# EAGLE schematic AmiExtFDD (EAGLE 6.5.0)
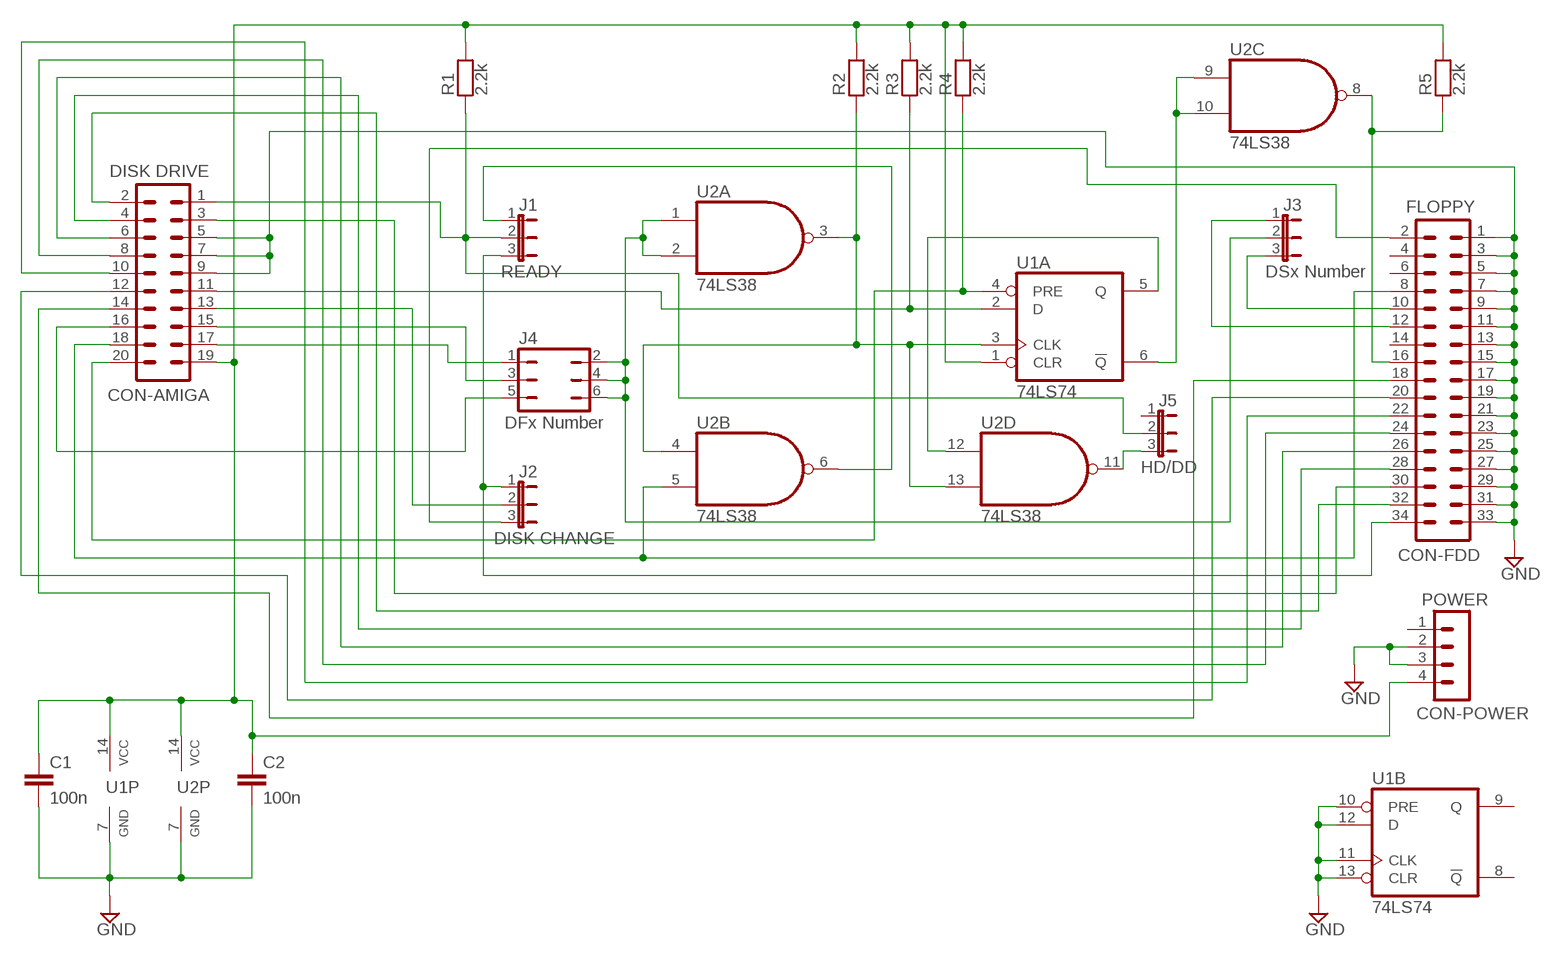
[diagram p0: schematic, sheet 1]

## Parts
C1  100n  PAD-C5SMD  [SMD-UNI]
C2  100n  PAD-C5SMD  [SMD-UNI]
CON-AMIGA  DISK DRIVE  IDC20  [IDC20]
CON-FDD  FLOPPY  FDD2  [FDD2]
CON-POWER  POWER  MIN-MOLEX  [MINI-MOLEX]
J1  READY  PAD-JP3X1UNI  [JP3X1-UNI]
J2  DISK CHANGE  PAD-JP3X1UNI  [JP3X1-UNI]
J3  DSx Number  PAD-JP3X1UNI  [JP3X1-UNI]
J4  DFx Number  PAD-JP3X2UNI  [JP3X2-UNI]
J5  HD/DD  PAD-JP3X1UNI  [JP3X1-UNI]
R1  2.2k  PAD-R10SMD  [SMD-UNI]
R2  2.2k  PAD-R10SMD  [SMD-UNI]
R3  2.2k  PAD-R10SMD  [SMD-UNI]
R4  2.2k  PAD-R10SMD  [SMD-UNI]
R5  2.2k  PAD-R10SMD  [SMD-UNI]
U1  74LS74  PAD-7474SO14  [SO14]
U2  74LS38  PAD-7438SO14  [SO14]

## Nets
GND: C1.2 C2.2 CON-AMIGA.5 CON-AMIGA.7 CON-AMIGA.9 CON-FDD.1 CON-FDD.3 CON-FDD.5 CON-FDD.7 CON-FDD.9 CON-FDD.11 CON-FDD.13 CON-FDD.15 CON-FDD.17 CON-FDD.19 CON-FDD.21 CON-FDD.23 CON-FDD.25 CON-FDD.27 CON-FDD.29 CON-FDD.31 CON-FDD.33 CON-POWER.2 CON-POWER.3 U1.7(P:GND) U1.10(B:PRE) U1.11(B:CLK) U1.12(B:D) U1.13(B:CLR) U2.7(P:GND)
N$1: CON-AMIGA.13 J2.2
N$2: U1.5(A:Q) U2.12(D:I0)
N$3: CON-FDD.16 R5.1 U2.8(C:O)
N$4: U1.6(A:!Q) U2.9(C:I0) U2.10(C:I1)
N$5: R2.1 U1.3(A:CLK) U2.3(A:O) U2.4(B:I0) U2.13(D:I1)
N$6: J5.3 U2.11(D:O)
N$7: CON-AMIGA.17 J4.1
N$9: CON-FDD.34 J1.3 J2.1
N$11: CON-FDD.2 J2.3
N$12: J1.1 U2.6(B:O)
N$13: CON-AMIGA.1 J1.2 J5.2 R1.1
N$15: CON-AMIGA.15 J4.3
N$16: CON-FDD.12 J3.1
N$17: CON-AMIGA.16 J4.5
N$19: J3.2 J4.2 J4.4 J4.6 U2.1(A:I0) U2.2(A:I1)
N$21: CON-AMIGA.18 CON-FDD.8 U2.5(B:I1)
N$22: CON-FDD.10 J3.3
N$23: CON-AMIGA.3 CON-FDD.30
N$24: CON-AMIGA.11 R3.1 U1.2(A:D)
N$25: C1.1 C2.1 CON-AMIGA.19 CON-POWER.4 R1.2 R2.2 R3.2 R4.2 R5.2 U1.1(A:CLR) U1.14(P:VCC) U2.14(P:VCC)
N$26: CON-AMIGA.4 CON-FDD.28
N$27: CON-AMIGA.6 CON-FDD.26
N$28: CON-AMIGA.2 CON-FDD.32
N$29: CON-AMIGA.8 CON-FDD.24
N$30: CON-AMIGA.10 CON-FDD.22
N$31: CON-AMIGA.12 CON-FDD.20
N$32: CON-AMIGA.14 CON-FDD.18
N$33: CON-AMIGA.20 R4.1 U1.4(A:PRE)
Unconnected: CON-FDD.4 CON-FDD.6 CON-FDD.14 J5.1 U1.8(B:!Q) U1.9(B:Q)

## Power pins joined to a net without a drawn wire
1: CON-POWER.1

## Library data of the parts
C1 C2 = _my:PAD-C5
CON-AMIGA = _my:IDC20
CON-FDD = _my:FDD
CON-POWER = _my:MIN-MOLEX
J1-J3 J5 = _my:PAD-JP3X1
J4 = _my:PAD-JP3X2
R1-R5 = _my:PAD-R10
U1 = _my:PAD-7474
U2 = _my:PAD-7438